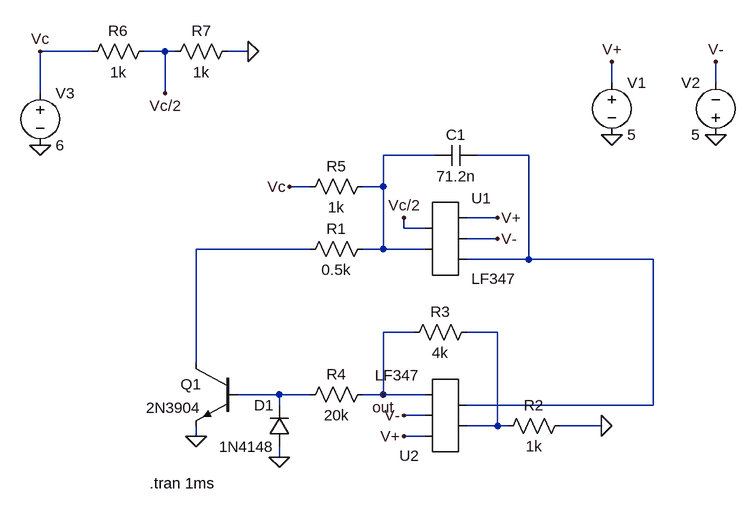
[diagram p0: schematic q2.asc]
q2.asc, the LTspice schematic file:
Version 4
SHEET 1 880 680
WIRE -240 -144 -320 -144
WIRE -128 -144 -160 -144
WIRE -112 -144 -128 -144
WIRE 0 -144 -32 -144
WIRE 560 -96 560 -128
WIRE 720 -96 720 -128
WIRE -320 -80 -320 -144
WIRE -128 -80 -128 -144
WIRE 288 16 208 16
WIRE 432 16 352 16
WIRE 96 64 64 64
WIRE 208 64 208 16
WIRE 208 64 176 64
WIRE 384 112 336 112
WIRE 240 128 240 112
WIRE 272 128 240 128
WIRE 384 144 336 144
WIRE 96 160 -80 160
WIRE 208 160 208 64
WIRE 208 160 176 160
WIRE 272 160 208 160
WIRE 432 176 432 16
WIRE 432 176 336 176
WIRE 624 176 432 176
WIRE 256 288 208 288
WIRE 384 288 336 288
WIRE -80 336 -80 160
WIRE 48 384 -16 384
WIRE 96 384 48 384
WIRE 208 384 208 288
WIRE 208 384 176 384
WIRE 272 384 208 384
WIRE 48 400 48 384
WIRE 624 400 624 176
WIRE 624 400 336 400
WIRE 272 416 240 416
WIRE 384 432 384 288
WIRE 384 432 336 432
WIRE 400 432 384 432
WIRE 544 432 480 432
WIRE -80 448 -80 432
WIRE 272 448 240 448
WIRE 48 480 48 464
FLAG 560 -16 0
FLAG 720 -16 0
FLAG 560 -128 V+
FLAG 720 -128 V-
FLAG 384 112 V+
FLAG 384 144 V-
FLAG 240 448 V+
FLAG 240 416 V-
FLAG -320 0 0
FLAG 0 -144 0
FLAG -320 -144 Vc
FLAG 64 64 Vc
FLAG 240 112 Vc/2
FLAG -128 -80 Vc/2
FLAG 48 480 0
FLAG -80 448 0
FLAG 544 432 0
FLAG 208 384 out
SYMBOL AutoGenerated\\LF347 304 144 R0
SYMATTR InstName U1
SYMBOL voltage 560 -112 R0
SYMATTR InstName V1
SYMATTR Value 5
SYMBOL voltage 720 0 R180
WINDOW 0 24 96 Left 2
WINDOW 3 24 16 Left 2
SYMATTR InstName V2
SYMATTR Value 5
SYMBOL AutoGenerated\\LF347 304 416 R180
SYMATTR InstName U2
SYMBOL res 192 144 R90
WINDOW 0 0 56 VBottom 2
WINDOW 3 32 56 VTop 2
SYMATTR InstName R1
SYMATTR Value 0.5k
SYMBOL res 496 416 R90
WINDOW 0 0 56 VBottom 2
WINDOW 3 32 56 VTop 2
SYMATTR InstName R2
SYMATTR Value 1k
SYMBOL res 352 272 R90
WINDOW 0 0 56 VBottom 2
WINDOW 3 32 56 VTop 2
SYMATTR InstName R3
SYMATTR Value 4k
SYMBOL cap 352 0 R90
WINDOW 0 0 32 VBottom 2
WINDOW 3 32 32 VTop 2
SYMATTR InstName C1
SYMATTR Value 71.2n
SYMBOL res 192 368 R90
WINDOW 0 0 56 VBottom 2
WINDOW 3 32 56 VTop 2
SYMATTR InstName R4
SYMATTR Value 20k
SYMBOL res 192 48 R90
WINDOW 0 0 56 VBottom 2
WINDOW 3 32 56 VTop 2
SYMATTR InstName R5
SYMATTR Value 1k
SYMBOL voltage -320 -96 R0
WINDOW 123 0 0 Left 0
WINDOW 39 0 0 Left 0
SYMATTR InstName V3
SYMATTR Value 6
SYMBOL res -144 -160 R90
WINDOW 0 0 56 VBottom 2
WINDOW 3 32 56 VTop 2
SYMATTR InstName R6
SYMATTR Value 1k
SYMBOL res -16 -160 R90
WINDOW 0 0 56 VBottom 2
WINDOW 3 32 56 VTop 2
SYMATTR InstName R7
SYMATTR Value 1k
SYMBOL diode 64 464 R180
WINDOW 0 24 64 Left 2
WINDOW 3 24 0 Left 2
SYMATTR InstName D1
SYMATTR Value 1N4148
SYMBOL npn -16 336 M0
SYMATTR InstName Q1
SYMATTR Value 2N3904
TEXT -152 520 Left 2 !.tran 1ms

The netlist it stands for:
* q2.asc
* U1: LF347 (symbol AutoGenerated\LF347 not available, pins judged from their places): pin1=Vc/2 pin2=N001 pin3=V+ pin4=V- pin5=N002
V1 V+ 0 5
V2 0 V- 5
* U2: LF347 (symbol AutoGenerated\LF347 not available, pins judged from their places): pin1=N004 pin2=N002 pin3=V+ pin4=V- pin5=out
R1 N001 N003 0.5k
R2 0 N004 1k
R3 N004 out 4k
C1 N002 N001 71.2n
R4 out N005 20k
R5 N001 Vc 1k
V3 Vc 0 6
R6 Vc/2 Vc 1k
R7 0 Vc/2 1k
D1 0 N005 1N4148
Q1 N003 N005 0 0 2N3904
.model D D
.lib standard.dio
.model NPN NPN
.model PNP PNP
.lib standard.bjt
.tran 1ms
.backanno
.end